# Altium schematic sheet [04] Half-Bridges.SchDoc
size B; Organization: Altium Limited; Address1: L3, 12a Rodborough Rd; Address2: Frenchs Forest; Address3: NSW; Address4: Australia 2086
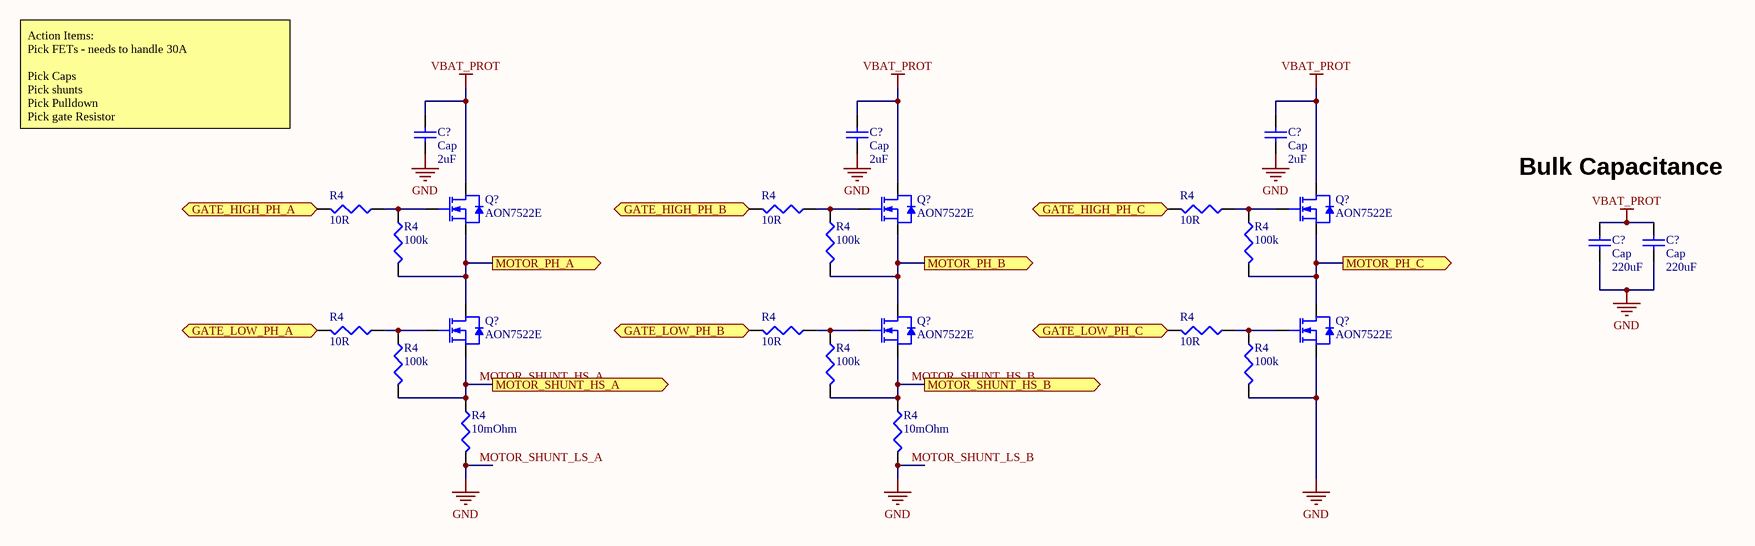
[diagram p0: [04] Half-Bridges.SchDoc]

## Parts
(Parts that share a designator on the sheet are numbered #1, #2 ... from top to bottom, then left to right.)
C?#1  Cap  value 2uF  [RAD-0.3]
C?#2  Cap  value 2uF  [RAD-0.3]
C?#3  Cap  value 2uF  [RAD-0.3]
C?#4  Cap  value 220uF  [RAD-0.3]
C?#5  Cap  value 220uF  [RAD-0.3]
Q?#1  AON7522E
Q?#2  AON7522E
Q?#3  AON7522E
Q?#4  AON7522E
Q?#5  AON7522E
Q?#6  AON7522E
R4#1  10R  [0603_CAP]
R4#2  100k  [0603_CAP]
R4#3  10R  [0603_CAP]
R4#4  100k  [0603_CAP]
R4#5  10R  [0603_CAP]
R4#6  100k  [0603_CAP]
R4#7  10R  [0603_CAP]
R4#8  100k  [0603_CAP]
R4#9  10R  [0603_CAP]
R4#10  100k  [0603_CAP]
R4#11  10R  [0603_CAP]
R4#12  100k  [0603_CAP]
R4#13  10mOhm  [0603_CAP]
R4#14  10mOhm  [0603_CAP]

## Ports
GATE_HIGH_PH_A (in), GATE_HIGH_PH_B (in), GATE_HIGH_PH_C (in), GATE_LOW_PH_A (in), GATE_LOW_PH_B (in), GATE_LOW_PH_C (in), MOTOR_PH_A (out), MOTOR_PH_B (out), MOTOR_PH_C (out), MOTOR_SHUNT_HS_A (out), MOTOR_SHUNT_HS_B (out)

## Nets
MOTOR_SHUNT_LS_A: C?#1.1 C?#2.1 C?#3.1 C?#4.1 C?#5.1 Q?#6.1(S) R4#12.2 R4#13.2 R4#14.2  [also labelled GND, MOTOR_SHUNT_LS_B]
VBAT_PROT: C?#1.2 C?#2.2 C?#3.2 C?#4.2 C?#5.2 Q?#1.8(D) Q?#2.8(D) Q?#3.8(D)
GATE_HIGH_PH_A: R4#1.2 ; port GATE_HIGH_PH_A
GATE_HIGH_PH_B: R4#3.2 ; port GATE_HIGH_PH_B
GATE_HIGH_PH_C: R4#5.2 ; port GATE_HIGH_PH_C
GATE_LOW_PH_A: R4#7.2 ; port GATE_LOW_PH_A
GATE_LOW_PH_B: R4#9.2 ; port GATE_LOW_PH_B
GATE_LOW_PH_C: R4#11.2 ; port GATE_LOW_PH_C
MOTOR_PH_A: Q?#1.1(S) Q?#4.8(D) R4#2.2 ; port MOTOR_PH_A
MOTOR_PH_B: Q?#2.1(S) Q?#5.8(D) R4#4.2 ; port MOTOR_PH_B
MOTOR_PH_C: Q?#3.1(S) Q?#6.8(D) R4#6.2 ; port MOTOR_PH_C
MOTOR_SHUNT_HS_A: Q?#4.1(S) R4#8.2 R4#13.1 ; port MOTOR_SHUNT_HS_A
MOTOR_SHUNT_HS_B: Q?#5.1(S) R4#10.2 R4#14.1 ; port MOTOR_SHUNT_HS_B
NetQ?#1_4: Q?#1.4(G) R4#1.1 R4#2.1
NetQ?#2_4: Q?#2.4(G) R4#3.1 R4#4.1
NetQ?#3_4: Q?#3.4(G) R4#5.1 R4#6.1
NetQ?#4_4: Q?#4.4(G) R4#7.1 R4#8.1
NetQ?#5_4: Q?#5.4(G) R4#9.1 R4#10.1
NetQ?#6_4: Q?#6.4(G) R4#11.1 R4#12.1

## Notes on the sheet
- Action Items:
  Pick FETs - needs to handle 30A
  Pick Caps
  Pick shunts
  Pick Pulldown
  Pick gate Resistor
- Bulk Capacitance
- Title
- Size:
- Date:
- B
- Number:
- Time:
- Revision:
- Sheet
- of
- File:

## Library data of the parts
C?#1-C?#5 = Cap: Capacitor; Published: 8-Jun-2000; LatestRevisionDate: 17-Jul-2002; LatestRevisionNote: Re-released for DXP Platform.; PackageReference: RAD-0.3; Publisher: Altium Limited; PackageDescription: Radial Cap, Thru-Hole; 2 Leads; 0.3 in Pin Spacing
Q?#1-Q?#6 = AON7522E: MOSFET N-CH 30V 21A 8DFN; Manufacturer: Alpha & Omega Semiconductor; FET Type: MOSFET N-Channel, Metal Oxide; FET Feature: Standard; Current - Continuous Drain (Id) @ 25°C: 21A (Ta), 34A (Tc); Rds On (Max) @ Id, Vgs: 4 mOhm @ 20A, 10V; Vgs(th) (Max) @ Id: 2.2V @ 250µA; Gate Charge (Qg) @ Vgs: 45nC @ 10V; Input Capacitance (Ciss) @ Vds: 1540pF @ 15V; Power - Max: 3.1W; Supplier 1: Digi-Key; Manufacturer Part Number: AON7522E; Stock 1: 20465; Pricing 1: 1=0.56, 10=0.471, 25=0.4124, 100=0.3535, 250=0.3064, 500=0.2592, 1000=0.2003, 2500=0.1826 (USD); Category: Discrete Semiconductor Products; Family: Transistors - FETs, MOSFETs - Single; Series: -; Packaging: Tape & Reel (TR); Drain to Source Voltage (Vdss): 30V; Operating Temperature: -55°C ~ 150°C (TJ); Mounting Type: Surface Mount; Package / Case: 8-PowerSMD, Flat Leads; Supplier Device Package: 8-DFN (3x3); ComponentLink1URL: https://datasheet.ciiva.com/6385/aon7522e-6385178.pdf; ComponentLink1Description: https://datasheet.ciiva.com/6385/aon7522e-6385178.pdf; ComponentLink2URL: https://datasheet.ciiva.com/6385/aon7522e-6385181.pdf; ComponentLink2Description: https://datasheet.ciiva.com/6385/aon7522e-6385181.pdf; ComponentLink3URL: https://datasheet.ciiva.com/6385/aon7522e-6385182.pdf; ComponentLink3Description: https://datasheet.ciiva.com/6385/aon7522e-6385182.pdf; Supplier Part Number 1: 785-1505-1-ND
R4#1-R4#14 = RC0603FR-073K3L: RES SMD 3.3K OHM 1% 1/10W 0603; Manufacturer 1: Yageo; Category 1: Resistors; Power (Watts): 0.1W, 1/10W; Temperature Coefficient: ±100ppm/°C; Supplier 1: Digi-Key; Manufacturer Part Number 1: RC0603FR-073K3L; RoHS: RoHS Compliant; Description 1: RES SMD 3.3K OHM 1% 1/10W 0603; Stock 1: 668905; Pricing 1: 1=0.1, 10=0.014, 25=0.01, 100=0.0057, 250=0.00436, 500=0.00348, 1000=0.00257, 2500=0.00223 (USD); Packaging: Cut Tape (CT); Resistance (Ohms): 3.3k; Tolerance: ±1%; Composition: Thick Film; Features: Moisture Resistant; Operating Temperature: -55°C ~ 155°C; Package / Case: 0603 (1608 Metric); Supplier Device Package: 0603; Size / Dimension: 0.063" L x 0.031" W (1.60mm x 0.80mm); Height: 0.022" (0.55mm); Number of Terminations: 2; ComponentLink1URL: http://www.yageo.com/documents/recent/PYu-RC_Group_51_RoHS_L_04.pdf; ComponentLink1Description: http://www.yageo.com/documents/recent/PYu-RC_Group_51_RoHS_L_04.pdf; Supplier Part Number 1: 311-3.30KHRCT-ND